# EAGLE design esp32-rs485 (EAGLE 9.6.2)
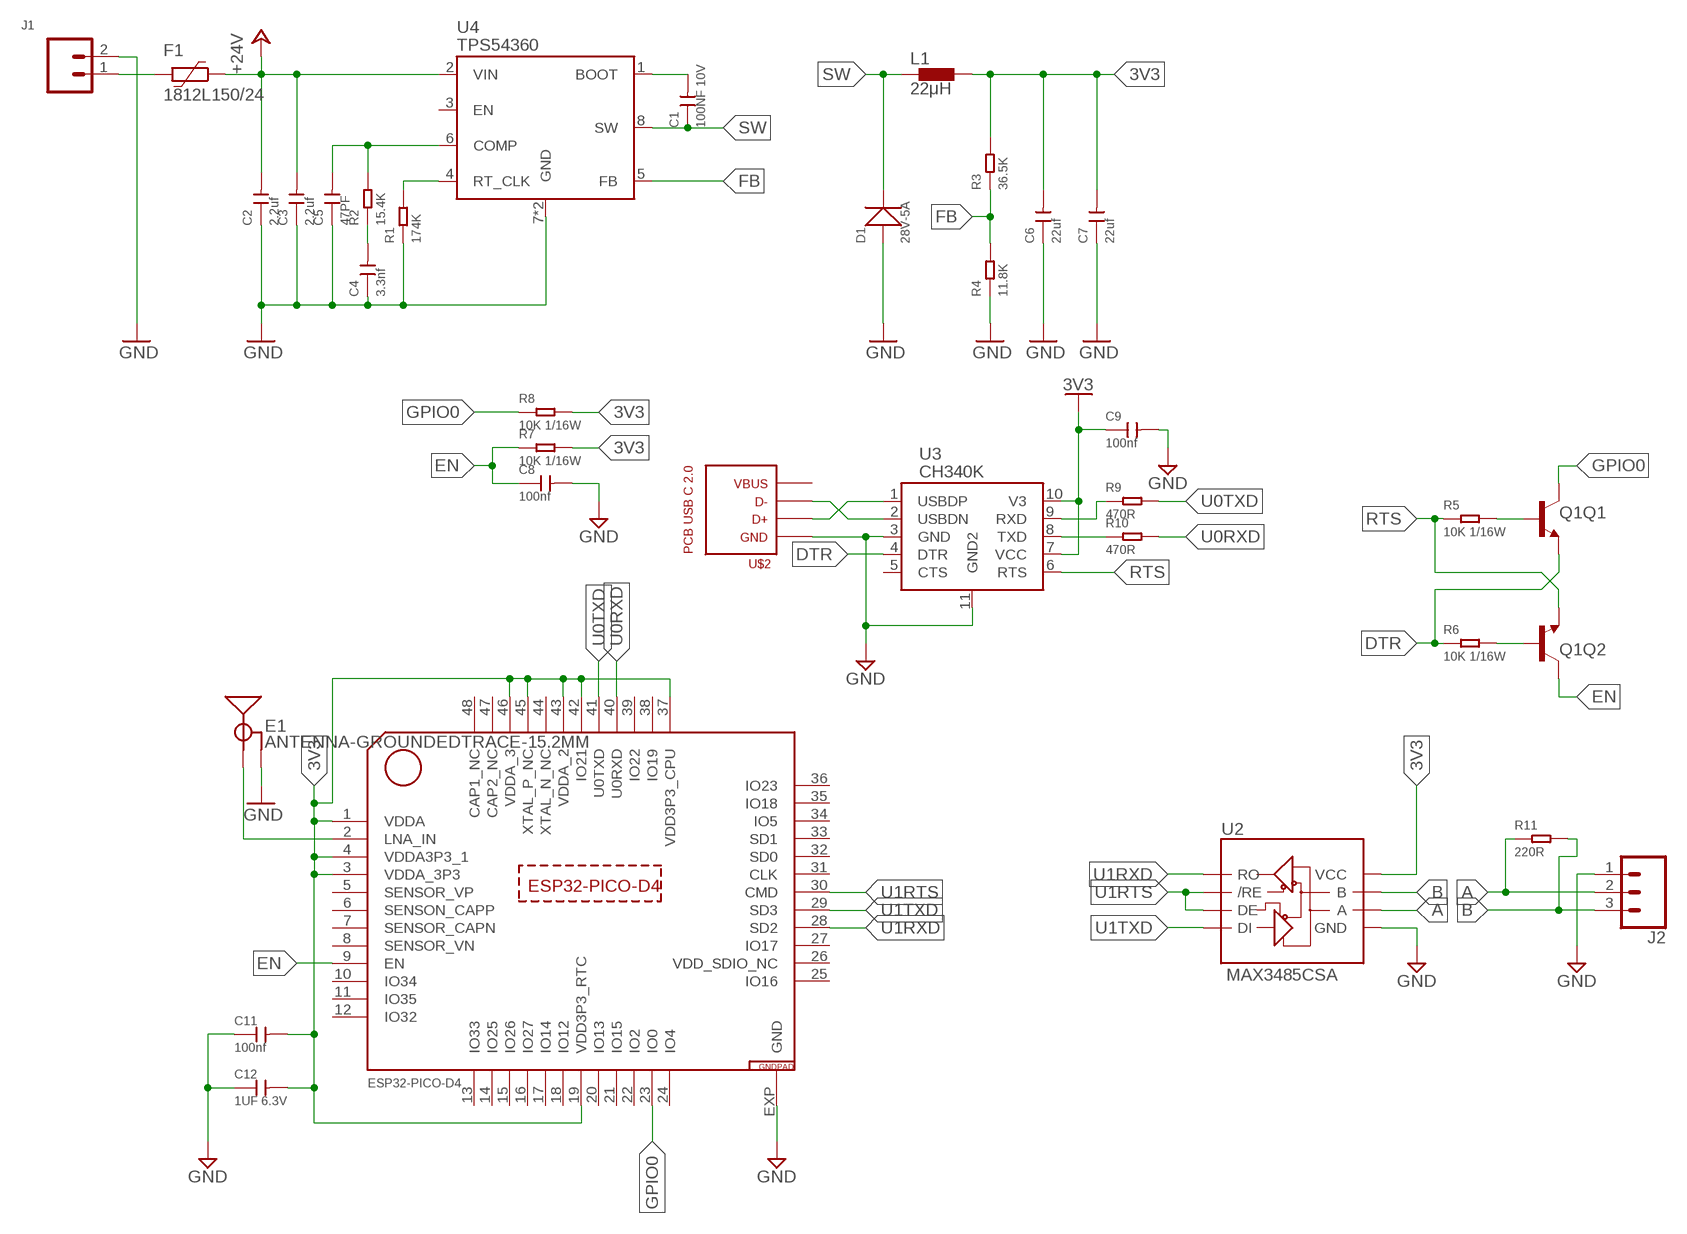
[diagram p0: schematic, sheet 1]

## Parts
C1  100NF 10V  CERAMIC 100NF-10V-10%-X5R(0402)  [C0402]
C2  2.2uf  CERAMIC-2.2UF-25V-10%-X7R(0805)  [C0805]
C3  2.2uf  CERAMIC-2.2UF-25V-10%-X7R(0805)  [C0805]
C4  3.3nf  CERAMIC-2.2NF-50V-10%-X7R(0402)  [C0402]
C5  47PF  CERAMIC-47PF-50V-5%-NP0(0402)  [C0402]
C6  22uf  CERAMIC-22UF-6.3V-20%-X5R(0805)  [C0805]
C7  22uf  CERAMIC-22UF-6.3V-20%-X5R(0805)  [C0805]
C8  100nf  CERAMIC-100NF-25V-10%-X7R(0402)  [C0402]
C9  100nf  CERAMIC-100NF-25V-10%-X7R(0402)  [C0402]
C11  100nf  CERAMIC-100NF-25V-10%-X7R(0402)  [C0402]
C12  1UF 6.3V  CERAMIC-1UF-6.3V-10%-X5R(0402)  [C0402]
D1  28V-5A  SMD-DIODE-SCHOTTKY-28V-5A(DO-214AA)  [DO-214AA]
E1  ANTENNA-GROUNDEDTRACE-15.2MM  [TRACE_ANTENNA_2.4GHZ_15.2MM]
F1  1812L150/24  [1812L]
J1  GREEN-2P-3.5  CONN_023.5MM  [SCREWTERMINAL-3.5MM-2]
J2  CONN_03SCREW  [SCREWTERMINAL-3.5MM-3]
L1  22μH  SHC0603-220M  [XTAL660X660X300N]
Q1  TRANS_NPN_DUAL-MBT3904DW1T1  [SC70-6]
R1  174K  SMD-RES-180R-1%-1/16W(0402)  [R0402]
R2  15.4K  SMD-RES-15K-1%-1/16W(0402)  [R0402]
R3  36.5K  SMD-RES-30K-5%-1/16W(0402)  [R0402]
R4  11.8K  SMD-RES-12K-1%-1/16W(0402)  [R0402]
R5  10K 1/16W  SMD-RES-10K-1%-1/16W(0402)  [R0402]
R6  10K 1/16W  SMD-RES-10K-1%-1/16W(0402)  [R0402]
R7  10K 1/16W  SMD-RES-10K-1%-1/16W(0402)  [R0402]
R8  10K 1/16W  SMD-RES-10K-1%-1/16W(0402)  [R0402]
R9  470R  SMD-RES-470R-1%-1/16W(0402)  [R0402]
R10  470R  SMD-RES-470R-1%-1/16W(0402)  [R0402]
R11  220R  SMD-RES-270R-1%-1/16W(0402)  [R0402]
U1  ESP32-PICO-D4  [QFN48]
U2  MAX3485CSA  RS485SOIC  [SO08]
U3  CH340K  [SOP100P600X180-11T230X320N]
U4  TPS54360  [SO08-PAD]
U$2  PCB_USB_C_2.0DS_2  [USB_TYPE_C_DS_2]

## Nets
3V3: C6.2 C7.2 C9.1 C11.2 C12.2 L1.2 R3.2 R7.2 R8.2 U1.1(VDDA) U1.3(VDDA_3P3) U1.4(VDDA3P3_1) U1.19(VDD3P3_RTC) U1.37(VDD3P3_CPU) U1.42(IO21) U1.43(VDDA_2) U1.45(XTAL_P_NC) U1.46(VDDA_3) U2.8(VCC) U3.7(VCC) U3.10(V3)
+24V: C2.2 C3.2 F1.1 U4.2(VIN)
A: J2.2 R11.1 U2.6(A)
B: J2.3 R11.2 U2.7(B)
DTR: Q1.4(Q1:E) R6.1 U3.4(DTR)
EN: C8.1 Q1.6(Q2:C) R7.1 U1.9(EN)
FB: R3.1 R4.2 U4.5(FB)
GND: C2.1 C3.1 C4.1 C5.1 C6.1 C7.1 C8.2 C9.2 C11.1 C12.1 D1.+ E1.GND J1.2 J2.1 R1.1 R4.1 U1.EXP(GND) U2.5(GND) U3.3(GND) U3.11(GND2) U4.7(GND) U4.TP(GND) U$2.A4(VBUS) U$2.A9(VBUS) U$2.B4(VBUS) U$2.B9(VBUS)
GPIO0: Q1.3(Q1:C) R8.1 U1.23(IO0)
N$1: E1.ANT(SIGNAL) U1.2(LNA_IN)
N$2: C1.2 U4.1(BOOT)
N$3: Q1.5(Q1:B) R5.2
N$4: F1.2 J1.1
N$6: R1.2 U4.4(RT_CLK)
N$8: C4.2 R2.1
N$9: Q1.2(Q2:B) R6.2
N$10: R10.1 U3.8(TXD)
N$11: R9.1 U3.9(RXD)
N$12: U3.2(USBDN) U$2.A6(D+) U$2.B6(D+)
N$13: U3.1(USBDP) U$2.A7(D-) U$2.B7(D-)
N$14: C5.2 R2.2 U4.6(COMP)
RTS: Q1.1(Q2:E) R5.1 U3.6(RTS)
SW: C1.1 D1.- L1.1 U4.8(SW)
U0RXD: R10.2 U1.40(U0RXD)
U0TXD: R9.2 U1.41(U0TXD)
U1RTS: U1.30(CMD) U2.2(/RE) U2.3(DE)
U1RXD: U1.28(SD2) U2.1(RO)
U1TXD: U1.29(SD3) U2.4(DI)
Unconnected: U1.5(SENSOR_VP) U1.6(SENSON_CAPP) U1.7(SENSOR_CAPN) U1.8(SENSOR_VN) U1.10(IO34) U1.11(IO35) U1.12(IO32) U1.13(IO33) U1.14(IO25) U1.15(IO26) U1.16(IO27) U1.17(IO14) U1.18(IO12) U1.20(IO13) U1.21(IO15) U1.22(IO2) U1.24(IO4) U1.25(IO16) U1.27(IO17) U1.31(CLK) U1.32(SD0) U1.33(SD1) U1.34(IO5) U1.35(IO18) U1.36(IO23) U1.38(IO19) U1.39(IO22) U1.44(XTAL_N_NC) U1.47(CAP2_NC) U1.48(CAP1_NC) U3.5(CTS) U4.3(EN) U$2.A1(GND) U$2.A12(GND) U$2.B1(GND) U$2.B12(GND)

## Power pins joined to a net without a drawn wire
VDD_SDIO_NC: U1.26(VDD_SDIO_NC)

## Library data of the parts
C1 = OPL_Capacitor:CERAMIC 100NF-10V-10%-X5R(0402): 302010037; MPN: CC0402KRX5R6BB104
C2 C3 = OPL_Capacitor:CERAMIC-2.2UF-25V-10%-X7R(0805): 302010148; MPN: CC0805KKX7R9BB225
C4 = OPL_Capacitor:CERAMIC-2.2NF-50V-10%-X7R(0402): 302010022; MPN: CC0402KRX7R9BB332; VALUE: 2.2nf
C5 = OPL_Capacitor:CERAMIC-47PF-50V-5%-NP0(0402): 302010007; MPN: CC0402JRNPO9BN470
C6 C7 = OPL_Capacitor:CERAMIC-22UF-6.3V-20%-X5R(0805): 302010171; MPN: CC0805MKX5R5BB226
C8 C9 C11 = OPL_Capacitor:CERAMIC-100NF-25V-10%-X7R(0402): 302010024; MPN: CC0402KRX7R8BB104
C12 = OPL_Capacitor:CERAMIC-1UF-6.3V-10%-X5R(0402): 302010003; MPN: CC0402KRX5R5BB105
D1 = OPL_Discrete_Semiconductor:SMD-DIODE-SCHOTTKY-28V-5A(DO-214AA): 304020021; MPN: SS54B
E1 = SparkFun-RF:ANTENNA-GROUNDED: Antenna w/ Ground Connection 2.4GHz antennae with signal and ground terminals. TRACE_ANTENNA_2.4GHZ_15.2MM - Meander Trace antenna 15.2 x 5.7mm footprint Based on layout from TI app note AN043 <http://www.ti.com/lit/an/swra117d/swra117d.pdf>. TRACE_ANTENNA_2.4GHZ_25.7MM - Inverted F trace antenna 25.7 x 7.5 mm footprint. Based on layout from TI design note DN0007 <http://www.ti.com/lit/an/swru120b/swru120b.pdf>.
F1 = polyfuse-smd_20:?: Polyfuse Resettable PTC Source: http://www.littelfuse.com/products/resettable-ptcs.aspx; MF: Littelfuse; MPN: 1812L150/24; OC_FARNELL: 2133084; OC_NEWARK: 05M2407
J1 = SparkFun-Connectors:CONN_02: Multi connection point. Often used as Generic Header-pin footprint for 0.1 inch spaced/style header connections On any of the 0.1 inch spaced packages, you can populate with these: Break Away Headers - Straight <https://www.sparkfun.com/products/116> (PRT-00116) Break Away Male Headers - Right Angle <https://www.sparkfun.com/products/553> (PRT-00553) Female Headers <https://www.sparkfun.com/products/115> (PRT-00115) Break Away Headers - Machine Pin <https://www.sparkfun.com/products/117> (PRT-00117) Break Away Female Headers - Swiss Machine Pin <https://www.sparkfun.com/products/743> (PRT-00743) For SCREWTERMINALS and SPRING TERMINALS visit here: Screw Terimnals on SparkFun.com <https://www.sparkfun.com/search/results?term=Screw+Terminals> (5mm/3.5mm/2.54mm spacing) This device is also useful as a general connection point to wire up your design to another part of your project. Our various solder wires solder well into these plated through hole pads. Hook-Up Wire - Assortment (Stranded, 22 AWG) <https://www.sparkfun.com/products/11375> (PRT-11375) Hook-Up Wire - Assortment (Solid Core, 22 AWG) <https://www.sparkfun.com/products/11367> (PRT-11367) View the entire wire category on our website here <https://www.sparkfun.com/categories/141> Special notes: Molex polarized connector foot print use with: PRT-08233 with associated crimp pins and housings. 2.54_SCREWTERM for use with PRT-10571. 3.5mm Screw Terminal footprints for PRT-08084 5mm Screw Terminal footprints for use with PRT-08432; PROD_ID: CONN-08399
J2 = SparkFun-Connectors:CONN_03: Multi connection point. Often used as Generic Header-pin footprint for 0.1 inch spaced/style header connections On any of the 0.1 inch spaced packages, you can populate with these: Break Away Headers - Straight <https://www.sparkfun.com/products/116> (PRT-00116) Break Away Male Headers - Right Angle <https://www.sparkfun.com/products/553> (PRT-00553) Female Headers <https://www.sparkfun.com/products/115> (PRT-00115) Break Away Headers - Machine Pin <https://www.sparkfun.com/products/117> (PRT-00117) Break Away Female Headers - Swiss Machine Pin <https://www.sparkfun.com/products/743> (PRT-00743) Stackable Header - 3 Pin (Female, 0.1") <https://www.sparkfun.com/products/13875> (PRT-13875) For SCREWTERMINALS and SPRING TERMINALS visit here: Screw Terimnals on SparkFun.com <https://www.sparkfun.com/search/results?term=Screw+Terminals> (5mm/3.5mm/2.54mm spacing) This device is also useful as a general connection point to wire up your design to another part of your project. Our various solder wires solder well into these plated through hole pads. Hook-Up Wire - Assortment (Stranded, 22 AWG) <https://www.sparkfun.com/products/11375> (PRT-11375) Hook-Up Wire - Assortment (Solid Core, 22 AWG) <https://www.sparkfun.com/products/11367> (PRT-11367) View the entire wire category on our website here <https://www.sparkfun.com/categories/141> Special notes: Molex polarized connector foot print use with SKU : PRT-08232 with associated crimp pins and housings.; PROD_ID: CONN-08288; SF_ID: PRT-08235
L1 = SHC0603:SHC0603: SMD Molding Power Inductor Features Magnetically shielded construction,low DC resistance The use of magnetic iron powder ensure capability for large Low audible core noise Ideal for DC-DC converter applications in hand held personal computer and etc Frequency Range:up to 3.0MHz RoHS compliant
Q1 = SparkFun-DiscreteSemi:TRANS_NPN_DUAL: Dual NPN Transistors in Single Package The MBT3904W1 puts two general purpose 3904 NPN transistors in a single package. Datasheet <http://www.onsemi.com/pub_link/Collateral/MBT3904DW1T1-D.PDF> SparkFun Products: SparkFun ESP32 Thing <https://www.sparkfun.com/products/13907>; PROD_ID: TRANS-13337
R1 = OPL_Resistor:SMD-RES-180R-1%-1/16W(0402): 301011986; MPN: RC0402FR-07174KL; VALUE: 0R
R2 = OPL_Resistor:SMD-RES-15K-1%-1/16W(0402): 301011985; MPN: RC0402FR-0715K4L; VALUE: 0R
R3 = OPL_Resistor:SMD-RES-30K-5%-1/16W(0402): 301012023; MPN: RC0402FR-0736K5L; VALUE: 0R
R4 = OPL_Resistor:SMD-RES-12K-1%-1/16W(0402): 301011982; MPN: RC0402FR-0711K8L; VALUE: 0R
R5-R8 = OPL_Resistor:SMD-RES-10K-1%-1/16W(0402): 301010047; MPN: RC0402FR-0710KL
R9 R10 = OPL_Resistor:SMD-RES-470R-1%-1/16W(0402): 301012000; MPN: RC0402JR-070RL; VALUE: 0R
R11 = OPL_Resistor:SMD-RES-270R-1%-1/16W(0402): 301011992; MPN: RC0402FR-07220RL; VALUE: 0R
U1 = ESP32-PICO-D4:ESP32-PICO-D4
U2 = SparkFun-IC-Comms:RS485: RS-485 Transceiver SP3485 Series 8 Pin NSOIC 3.3 V Low Power Half Duplex RS-485 Transceiver MAX3485 compatible Datasheet <http://www.sparkfun.com/datasheets/Components/General/sp3485CN-LTR.pdf> SparkFun Products SparkFun Transceiver Breakout - RS-485 <https://www.sparkfun.com/products/10124> (BOB-10124) SparkFun USB to RS-485 Converter <https://www.sparkfun.com/products/9822> (BOB-09822); PROD_ID: IC-09388
U3 = CH340K:CH340: USB to UART Bridge Controller CH340 Introduction CH340 is a USB converter chip, which converts USB to serial UART interface or to printer interface. In UART mode, CH340 provides common MODEM interface signals, to expand UART interface of computer or upgrade common serial communication devices to USB directly. For more information about converting USB to printer interface, please refer to the datasheet CH340DS2. Features Full speed USB device interface, USB 2.0 compatible. Emulate standard UART interface, used to upgrade the original serial devices or expand additional UART via USB. Original UART applications are totally compatible without any modification. Hardware full duplex serial UART interface, integrated transmit-receive buffer, supports communication baudrates varies from 50bps to 2Mbps. Supports common MODEM interface signals RTS, DTR, DCD, RI, DSR and CTS. Provides further RS232, RS485, RS422 interface, etc. through external voltage conversion chip. CH340R supports IrDA specification SIR infrared communication, supports baudrates varies from 2400bps to 115200bps. Software compatible with CH341, customers can use driver of CH341 directly. Supports 5V and 3.3V power supply even supports as low as 3V. CH340C/N/K/E and CH340B integrate 12MHz clock, no external crystal required, CH340B also integrates EEPROM used to configure the serial number, etc. RoHS compliant SOP-16, SOP-8, SSOP-20 and ESSOP-10, MSOP-10 lead-free package.
U4 = we-power:TPS54360: TI TPS54360 Step-Down (100kHz-2.5MHz, 3.5A, 4.5-60V input)
U$2 = USB_pcb_connectors:PCB_USB_C_2.0

## Board
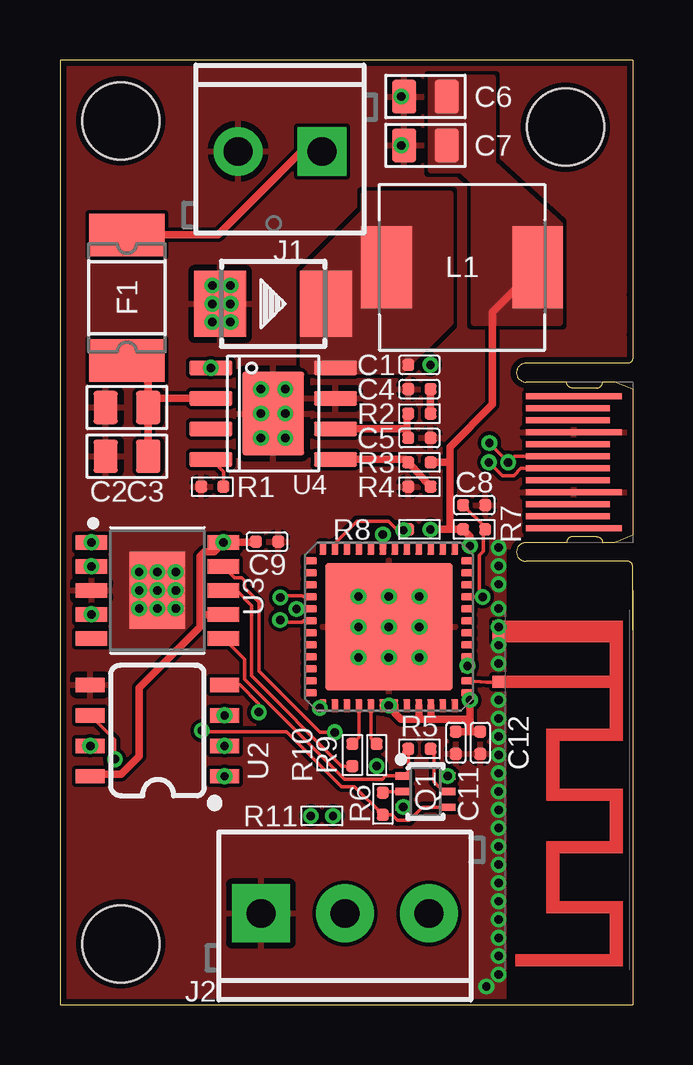
[diagram p1: board, top side]
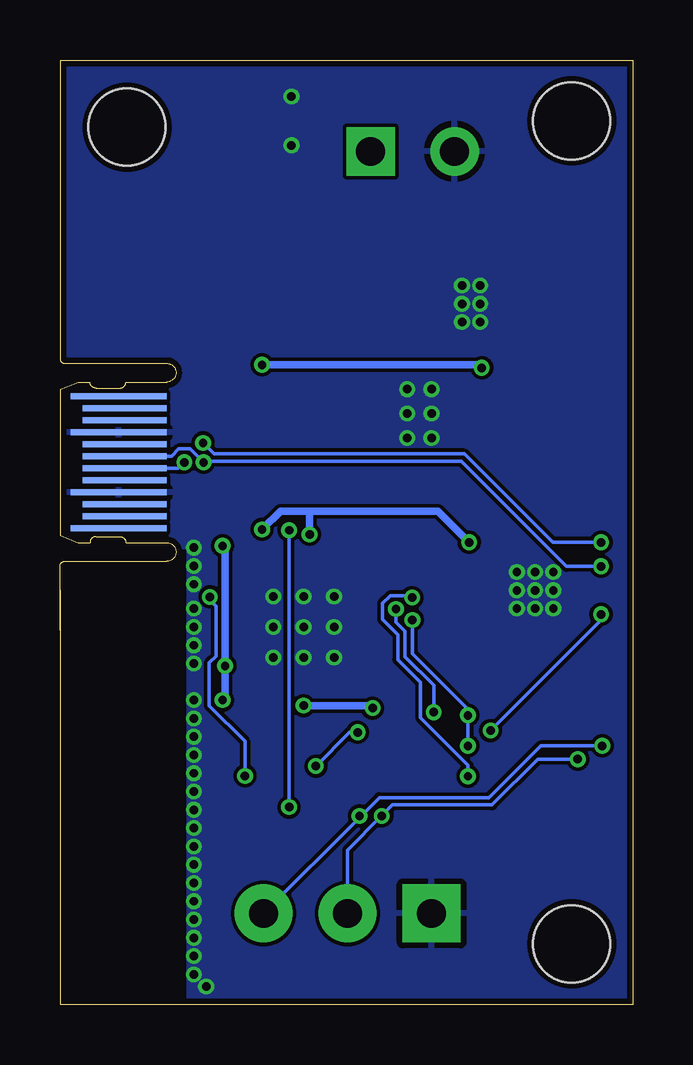
[diagram p2: board, bottom side, seen from below]

Size 23.88 x 39.37 mm. Coordinates in mm from the lower left corner, seen from the top.
Outline: 23.88,17.27 23.88,0 0,0 0,39.37 23.88,39.37 23.88,27.94
Copper layers (1*16): Top 0.035mm / dielectric 1.5mm / Bottom 0.035mm
Design rules "SeeedStudio_2layer_DRU_no_angle_20140221": minimum track width 6mil, minimum drill 12mil, track to track 6mil, track to pad 6mil, pad to pad 6mil, via to via 6mil, smd to smd 0mil, copper to edge 10mil, drill to drill 10mil, minimum pad ring 10mil, minimum via ring 6mil, stop-mask expansion 2mil, vias tented up to drill 100mil, thermal gap 10mil
Holes 3.2 mm at 2.54,2.54 21.08,36.58 2.54,36.83

### Footprints (pad centres in the part's own frame; a part is rotated, then mirrored left to right if it is on the bottom)
C0402 = smd 0.5 x 0.5: 1 0,0.463; 2 0,-0.463
C0805 = smd 1.397 x 1.016: 1 0,0.889; 2 0,-0.889
DO-214AA = smd 2.159 x 2.743: + -2.21,0; - 2.21,0
TRACE_ANTENNA_2.4GHZ_15.2MM = smd 0.5 x 0.5: ANT 0,-0.25 | smd 0.9 x 0.5: GND -2.1,-0.25
1812L = smd 1.78 x 3.15: 1 -2.62,0; 2 2.62,0
SCREWTERMINAL-3.5MM-2 = drill 1.2 pad 2.032 square: 1 0,0 | drill 1.2 pad 2.032: 2 3.5,0
SCREWTERMINAL-3.5MM-3 = drill 1.2 pad 2.413 square: 1 0,0 | drill 1.2 pad 2.413: 2 3.5,0; 3 7,0
XTAL660X660X300N = smd 2.108 x 3.429: 1 -3.151,0; 2 3.151,0
SC70-6 = smd 0.3 x 0.66: 1 -0.65,-0.92; 2 0,-0.92; 3 0.65,-0.92; 4 0.65,0.92; 5 0,0.92; 6 -0.65,0.92
R0402 = smd 0.5 x 0.5: 1 0,0.463; 2 0,-0.463
QFN48 = smd 0.55 x 0.3: 1 -3.275,2.75; 2 -3.275,2.25; 3 -3.275,1.75; 4 -3.275,1.25; 5 -3.275,0.75; 6 -3.275,0.25; 7 -3.275,-0.25; 8 -3.275,-0.75; 9 -3.275,-1.25; 10 -3.275,-1.75; 11 -3.275,-2.25; 12 -3.275,-2.75; 25 3.275,-2.75; 26 3.275,-2.25; 27 3.275,-1.75; 28 3.275,-1.25; 29 3.275,-0.75; 30 3.275,-0.25; 31 3.275,0.25; 32 3.275,0.75; 33 3.275,1.25; 34 3.275,1.75; 35 3.275,2.25; 36 3.275,2.75 | smd 0.3 x 0.55: 13 -2.75,-3.275; 14 -2.25,-3.275; 15 -1.75,-3.275; 16 -1.25,-3.275; 17 -0.75,-3.275; 18 -0.25,-3.275; 19 0.25,-3.275; 20 0.75,-3.275; 21 1.25,-3.275; 22 1.75,-3.275; 23 2.25,-3.275; 24 2.75,-3.275; 37 2.75,3.275; 38 2.25,3.275; 39 1.75,3.275; 40 1.25,3.275; 41 0.75,3.275; 42 0.25,3.275; 43 -0.25,3.275; 44 -0.75,3.275; 45 -1.25,3.275; 46 -1.75,3.275; 47 -2.25,3.275; 48 -2.75,3.275 | smd 5.309 x 5.309: EXP 0,0
SO08 = smd 0.6 x 1.2: 1 -1.905,-2.8; 2 -0.635,-2.8; 3 0.635,-2.8; 4 1.905,-2.8; 5 1.905,2.8; 6 0.635,2.8; 7 -0.635,2.8; 8 -1.905,2.8
SOP100P600X180-11T230X320N = smd 1.312 x 0.602: 1 -2.75,2; 2 -2.75,1; 3 -2.75,0; 4 -2.75,-1; 5 -2.75,-2; 6 2.75,-2; 7 2.75,-1; 8 2.75,0; 9 2.75,1; 10 2.75,2 | smd 2.3 x 3.2: 11 0,0
SO08-PAD = smd 1.8 x 0.6: 1 -2.6,1.905; 2 -2.6,0.635; 3 -2.6,-0.635; 4 -2.6,-1.905; 5 2.6,-1.905; 6 2.6,-0.635; 7 2.6,0.635; 8 2.6,1.905 | smd 2.6 x 3.5: TP 0,0
USB_TYPE_C_DS_2 = smd 0.25 x 4: A1 2.75,-2.45; A4 1.25,-2.45; A9 -1.25,-2.45; A12 -2.75,-2.45 | smd 0.25 x 3.5: A2 2.25,-2.7; A3 1.75,-2.7; A5 0.75,-2.7; A6 0.25,-2.7; A7 -0.25,-2.7; A8 -0.75,-2.7; A10 -1.75,-2.7; A11 -2.25,-2.7 | smd 0.25 x 4 bottom: B1 -2.75,-2.45; B4 -1.25,-2.45; B9 1.25,-2.45; B12 2.75,-2.45 | smd 0.25 x 3.5 bottom: B2 -2.25,-2.7; B3 -1.75,-2.7; B5 -0.75,-2.7; B6 -0.25,-2.7; B7 0.25,-2.7; B8 0.75,-2.7; B10 1.75,-2.7; B11 2.25,-2.7

### Placement (x,y rotation side)
C1  14.99,26.67 90 top
C2  2.79,24.89 90 top
C3  2.79,22.86 90 top
C4  14.99,25.65 90 top
C5  14.99,23.62 270 top
C6  15.24,37.85 90 top
C7  15.24,35.81 90 top
C8  17.27,20.83 90 top
C9  8.64,19.3 90 top
C11  16.51,10.92 180 top
C12  17.53,10.92 180 top
D1  8.89,29.21 0 top
E1  18.54,13.46 270 top
F1  2.79,29.46 90 top
J1  10.92,35.56 180 top
J2  8.38,3.81 0 top
L1  16.76,30.73 0 top
Q1  15.24,8.89 270 top
R1  6.35,21.59 90 top
R2  14.99,24.64 270 top
R3  14.99,22.61 90 top
R4  14.99,21.59 90 top
R5  14.99,10.67 90 top
R6  13.46,8.38 180 top
R7  17.27,19.81 270 top
R8  14.99,19.81 90 top
R9  13.21,10.41 180 top
R10  12.19,10.41 180 top
R11  10.92,7.87 90 top
U1  13.72,15.75 180 top
U2  4.06,11.43 90 top
U3  4.06,17.27 0 top
U4  8.89,24.64 0 top
U$2  23.88,22.61 270 top

### Tracks (layer width: path | path; a pad name or v marks a point on that pad's centre or on a via)
3V3  (via drill 0.35)
  Top 0.305: R8.2 16.25,19.81 | 16.25,19.81 R7.2 17.1,19.53 v17.1,19.13 | 16.25,19.81 16.25,22.61 | R3.2 16.25,22.61 | U2.8 1.35,9.61 2.55,9.61 3.3,10.36 3.3,13.21 5.84,15.75 5.84,16.26 | 5.84,16.26 5.84,18.69 6.03,18.88 6.42,18.88 U3.10 8.14,19.27 C9.1 | U3.7 6.8,16.26 5.84,16.26 | U1.4 v16.99,14.13 U1.3 | U1.1 17.1,12.89 v17.1,12.7 17.1,11.89 | 15.47,11.89 14.97,11.89 | U1.45 14.97,11.89 | U1.46 15.47,11.89 | U1.37 10.84,12.47 v10.84,12.37 | U1.42 v13.72,12.47 U1.43 13.97,12.14 14.22,11.89 14.97,11.89 | C12.2 17.1,11.38 | 17.1,11.38 C11.2 | 17.1,11.89 17.1,11.38 | 15.47,11.89 17.1,11.89 | U1.19 v13.47,19.6 | 16.25,22.61 16.25,23.24 18.03,25.02 18.03,28.85 L1.2
  Bottom 0.305: R8.2 14.69,20.57 13.46,20.57 | 13.46,20.57 8.12,20.57 U3.10 | v17.1,19.13 16.99,19.02 v16.99,14.13 16.99,12.8 v17.1,12.7 | v10.84,12.37 10.94,12.47 v13.72,12.47 | v13.47,19.6 v13.46,19.6 13.46,20.57
  other vias: 15.45,19.81 6.81,19.27
  pour Top (no thermals): 17.27,34.29 17.27,28.45 20.83,28.45 20.83,32.51 18.03,35.05 18.03,38.61 15.49,38.61 15.49,34.8 16.76,34.8
+24V
  Top 0.305: F1.1 3.68,25.95 C2.2 | C2.2 C3.2 | C2.2 4.06,25.27 U4.2
A  (via drill 0.35)
  Top 0.152: U2.6 2.29,11.04 v2.29,10.24
  Bottom 0.152: v2.29,10.24 3.95,10.24 5.86,8.33 10,8.33 R11.1 11.88,6.45 J2.2
  other vias: 10.46,7.87
B  (via drill 0.35)
  Top 0.152: R11.2 11.38,7.83
  Bottom 0.152: U2.7 3.83,10.79 5.98,8.64 10.56,8.64 11.37,7.82 | 11.37,7.82 J2.3 | R11.2 11.38,7.83 11.37,7.82
  other vias: 1.26,10.79 11.38,7.87
DTR  (via drill 0.35)
  Top 0.152: v5.92,11.43 5.96,11.38 9.45,11.38 11.75,9.09 12.29,9.09 R6.1 13.84,7.92 14.07,7.68 14.57,7.68 15.12,8.24 Q1.4
  Bottom 0.152: v5.92,11.43 1.31,16.04 U3.4
  other vias: 1.31,16.27
EN  (via drill 0.35)
  Top 0.152: U1.9 v17.62,17 17.5,17.13 17.5,18.74 17.65,18.9 17.65,19.73 R7.1 17.73,19.9 C8.1
  Bottom 0.152: v17.62,17 17.62,16.86 17.37,16.61 17.37,14.53 17.65,14.25 17.65,12.47 16.16,10.98 Q1.6
  other vias: 16.16,9.54
FB
  Top 0.305: R4.2 R3.1 14.4,22.73 U4.5
GND  (via drill 0.35)
  other vias: 7.11,29.97 6.35,29.97 6.35,29.21 6.35,28.45 7.11,28.45 7.11,29.21 14.22,35.81 14.22,37.85 8.38,25.65 9.4,25.65 9.4,24.64 8.38,24.64 8.38,23.62 9.4,23.62 4.06,17.27 3.3,17.27 3.3,16.51 4.06,16.51 4.83,16.51 4.83,17.27 4.83,18.03 4.06,18.03 3.3,18.03 13.72,15.75 14.99,15.75 12.45,15.75 12.45,14.48 13.72,14.48 14.99,14.48 14.99,17.02 12.45,17.02 13.72,17.02 18.29,14.22 18.29,14.99 18.29,15.75 18.29,16.51 18.29,17.53 18.29,18.29 18.29,19.05 18.29,12.7 18.29,11.94 18.29,11.18 18.29,10.41 18.29,9.65 18.29,8.89 18.29,8.13 18.29,7.37 18.29,6.6 18.29,5.84 18.29,5.08 18.29,4.32 18.29,3.56 18.29,2.79 18.29,2.03 18.29,1.27 17.78,0.76
  pour Bottom (rank 6): 0,39.37 0,0 18.54,0 18.54,19.05 23.88,19.05 23.88,39.37
  pour Top (rank 6): 0,39.37 0,0 18.54,0 18.54,19.05 23.88,19.05 23.88,39.37
GPIO0  (via drill 0.35)
  Top 0.152: U1.23 11.47,19.25 12.38,20.16 13.7,20.16 14.04,19.81 R8.1 14.35,19.81 v14.32,19.78
  Bottom 0.152: Q1.3 v14.32,19.78
  other vias: 14.32,8.24
N$1
  Top 0.152: E1.ANT arc-8 17.53,13.46 U1.2
N$2  (via drill 0.35)
  Bottom 0.305: C1.2 6.42,26.67 U4.1
  other vias: 15.45,26.67 6.29,26.54
N$3
  Top 0.152: R5.2 15.6,10.51 15.6,9.29 16.01,8.89 Q1.5
N$4
  Top 0.305: J1.1 10.08,35.56 6.6,32.08 F1.2
N$6
  Top 0.152: U4.4 6.81,22.21 R1.2
N$8
  Top 0.305: R2.1 C4.2
N$9
  Top 0.152: R6.2 13.51,8.89 Q1.2
N$10
  Top 0.152: U3.8 7.37,17.27 8,16.64 8,13.7 11.75,9.95 R10.1
N$11  (via drill 0.35)
  Top 0.152: v11.46,11.36 10.85,11.36 8.3,13.91 8.3,16.77 7.7,17.37 7.7,17.67 7.57,17.8 7.29,17.8 U3.9
  Bottom 0.152: R9.1 11.8,11.36 v11.46,11.36
  other vias: 13.21,9.95
N$12  (via drill 0.35)
  Top 0.152: U$2.A6 19.23,22.36 18.92,22.05 18.44,22.05 v17.89,22.61
  Bottom 0.152: U$2.B6 19.23,22.86 18.92,23.16 18.44,23.16 v17.89,22.61 17.83,22.66 7.14,22.66 2.75,18.27 U3.2
  other vias: 1.31,18.27
N$13  (via drill 0.35)
  Top 0.152: U$2.A7 18.94,22.86 v18.69,22.61 17.91,23.39 v17.91,23.41
  Bottom 0.152: v18.69,22.61 18.94,22.36 U$2.B7 | v17.91,23.41 17.45,22.96 7.01,22.96 3.32,19.27 U3.1
  other vias: 1.31,19.27
N$14
  Top 0.305: U4.6 14.48,24 | 14.48,24 14.48,23.67 C5.2 | R2.2 14.48,24.64 14.48,24
RTS
  Top 0.152: R5.1 14.52,9.74 Q1.1 13.58,9.54 13.44,9.4 11.88,9.4 7.69,13.58 7.69,14.39 U3.6
SW
  pour Top (no thermals): 10.16,26.67 10.41,26.42 14.22,26.42 16.26,28.45 16.26,33.78 12.7,33.78 12.7,33.02 10.16,30.48
U0RXD
  Top 0.152: U1.40 12.47,11.15 R10.2
U0TXD
  Top 0.152: R9.2 12.97,11.12 U1.41
U1RTS  (via drill 0.35)
  Top 0.152: U1.30 10.15,16 10.09,15.94 9.28,15.94 v9.18,16.04
  Bottom 0.152: v9.18,16.04 9.18,14.64 6.86,12.32 U2.3 U2.2
  other vias: 6.86,12.06 6.86,10.79
U1RXD  (via drill 0.35)
  Top 0.152: U1.28 10.15,17 10.09,17.05 9.28,17.05 v9.19,16.97
  Bottom 0.152: U2.1 6.86,9.98 8.85,11.96 8.85,13.44 9.79,14.38 9.79,15.43 10.42,16.06 10.42,16.73 10.09,17.05 9.28,17.05 v9.19,16.97
  other vias: 6.86,9.53
U1TXD  (via drill 0.35)
  Top 0.152: U1.29 v9.86,16.5 | v8.29,12.2 8.29,12.55 7.5,13.33 U2.4
  Bottom 0.152: v8.29,12.2 8.29,13.31 9.49,14.51 9.49,15.56 9.86,15.94 v9.86,16.5

### Text on the board
tDocu: USB 2.0 / Type C